# EAGLE design 4WaySwitch4LProto (EAGLE 4.13)
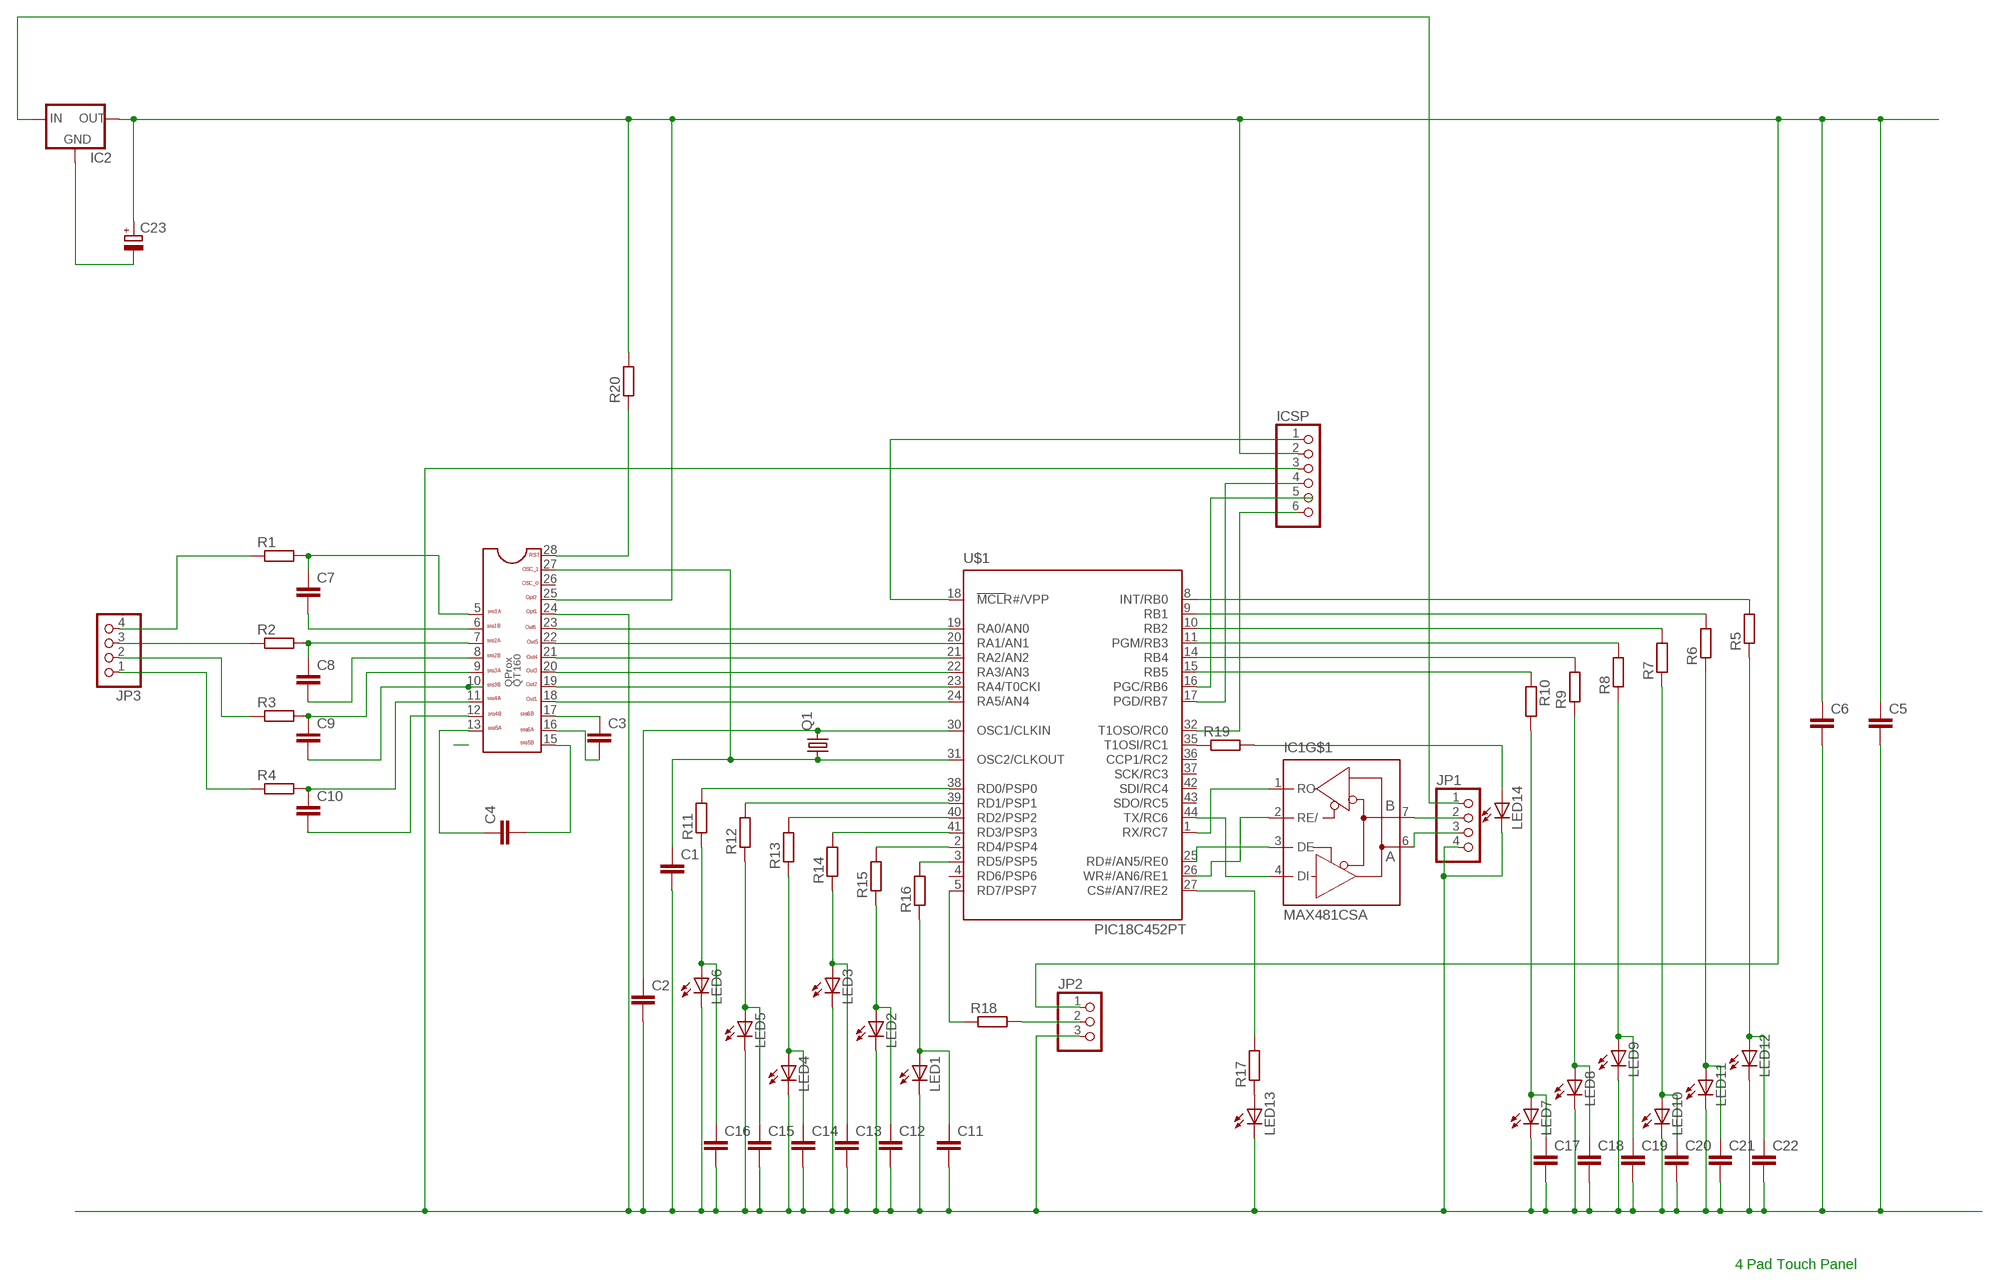
[diagram p0: schematic, sheet 1]

## Parts
C1  C-EUC0805  [C0805]
C2  C-EUC0805  [C0805]
C3  C-EUC0805  [C0805]
C4  C-EUC0805  [C0805]
C5  C-EUC0805  [C0805]
C6  C-EUC0805  [C0805]
C7  C-EUC0805  [C0805]
C8  C-EUC0805  [C0805]
C9  C-EUC0805  [C0805]
C10  C-EUC0805  [C0805]
C11  C-EUC1206  [C1206]
C12  C-EUC1206  [C1206]
C13  C-EUC1206  [C1206]
C14  C-EUC1206  [C1206]
C15  C-EUC1206  [C1206]
C16  C-EUC1206  [C1206]
C17  C-EUC1206  [C1206]
C18  C-EUC1206  [C1206]
C19  C-EUC1206  [C1206]
C20  C-EUC1206  [C1206]
C21  C-EUC1206  [C1206]
C22  C-EUC1206  [C1206]
C23  CPOL-EUD/7343-31W  [D/7343-31W]
IC1  MAX481CSA  [SO08]
IC2  78LXX  [78LXX]
ICSP  PINHD-1X6  [1X06]
JP1  PINHD-1X4  [1X04]
JP2  PINHD-1X3  [1X03]
JP3  PINHD-1X4  [1X04]
LED1  LEDSMT1206  [1206]
LED2  LEDSMT1206  [1206]
LED3  LEDSMT1206  [1206]
LED4  LEDSMT1206  [1206]
LED5  LEDSMT1206  [1206]
LED6  LEDSMT1206  [1206]
LED7  LEDSMT1206  [1206]
LED8  LEDSMT1206  [1206]
LED9  LEDSMT1206  [1206]
LED10  LEDSMT1206  [1206]
LED11  LEDSMT1206  [1206]
LED12  LEDSMT1206  [1206]
LED13  LEDSMT1206  [1206]
LED14  LEDSMT1206  [1206]
Q1  CRYTALHC49S  [HC49/S]
R1  R-EU_R0805  [R0805]
R2  R-EU_R0805  [R0805]
R3  R-EU_R0805  [R0805]
R4  R-EU_R0805  [R0805]
R5  R-EU_R0805  [R0805]
R6  R-EU_R0805  [R0805]
R7  R-EU_R0805  [R0805]
R8  R-EU_R0805  [R0805]
R9  R-EU_R0805  [R0805]
R10  R-EU_R0805  [R0805]
R11  R-EU_R0805  [R0805]
R12  R-EU_R0805  [R0805]
R13  R-EU_R0805  [R0805]
R14  R-EU_R0805  [R0805]
R15  R-EU_R0805  [R0805]
R16  R-EU_R0805  [R0805]
R17  R-EU_R1206  [R1206]
R18  R-EU_R1210  [R1210]
R19  R-EU_M1206  [M1206]
R20  R-EU_M1206  [M1206]
U$1  PIC18C452PT  [TQFP44]
U$2  QPROX160  [SSOP28]

## Nets
GND: C1.2 C2.2 C5.2 C6.2 C11.2 C12.2 C13.2 C14.2 C15.2 C16.2 C17.2 C18.2 C19.2 C20.2 C21.2 C22.2 ICSP.3 JP1.4 JP2.3 LED1.C LED2.C LED3.C LED4.C LED5.C LED6.C LED7.C LED8.C LED9.C LED10.C LED11.C LED12.C LED13.C LED14.C U$2.24(OPT1)
N$1: IC1.4(DI) U$1.44(TX/RC6)
N$2: IC1.1(RO) U$1.1(RX/RC7)
N$3: IC1.3(DE) U$1.25(RD#/AN5/RE0)
N$4: IC1.2(RE/) U$1.26(WR#/AN6/RE1)
N$5: U$1.19(RA0/AN0) U$2.23(OUT6)
N$6: U$1.20(RA1/AN1) U$2.22(OUT5)
N$7: U$1.21(RA2/AN2) U$2.21(OUT4)
N$8: U$1.22(RA3/AN3) U$2.20(OUT3)
N$9: U$1.23(RA4/T0CKI) U$2.19(OUT2)
N$10: U$1.24(RA5/AN4) U$2.18(OUT1)
N$11: C2.1 Q1.2 U$1.30(OSC1/CLKIN)
N$12: C1.1 Q1.1 U$1.31(OSC2/CLKOUT) U$2.27(OSCI)
N$13: C3.1 U$2.17(SNS6B)
N$14: C3.2 U$2.16(SNS6A)
N$15: C4.2 U$2.15(SNS5B)
N$16: C4.1 U$2.13(SNS5A)
N$17: R11.2 U$1.38(RD0/PSP0)
N$18: R12.2 U$1.39(RD1/PSP1)
N$19: C7.1 R1.2 U$2.5(SNS1A)
N$20: C7.2 U$2.6(SNS1B)
N$21: C8.1 R2.2 U$2.7(SNS2A)
N$22: C8.2 U$2.8(SNS2B)
N$23: C9.1 R3.2 U$2.9(SNS3A)
N$24: C9.2 U$2.10(SNS3B)
N$25: C10.1 R4.2 U$2.11(SNS4A)
N$26: C10.2 U$2.12(SNS4B)
N$27: R5.2 U$1.8(INT/RB0)
N$28: R6.2 U$1.9(RB1)
N$29: R7.2 U$1.10(RB2)
N$30: R8.2 U$1.11(PGM/RB3)
N$31: R9.2 U$1.14(RB4)
N$32: R10.1 U$1.15(RB5)
N$33: R13.2 U$1.40(RD2/PSP2)
N$34: R14.2 U$1.41(RD3/PSP3)
N$35: R15.2 U$1.2(RD4/PSP4)
N$36: R16.2 U$1.3(RD5/PSP5)
N$37: C11.1 LED1.A R16.1
N$38: C12.1 LED2.A R15.1
N$39: C16.1 LED6.A R11.1
N$40: C15.1 LED5.A R12.1
N$41: C14.1 LED4.A R13.1
N$42: C13.1 LED3.A R14.1
N$43: C17.1 LED7.A R10.2
N$44: C18.1 LED8.A R9.1
N$45: C19.1 LED9.A R8.1
N$46: C20.1 LED10.A R7.1
N$47: C21.1 LED11.A R6.1
N$48: C22.1 LED12.A R5.1
N$49: ICSP.1 U$1.18(MCLR#/VPP)
N$50: JP3.4 R1.1
N$51: JP3.3 R2.1
N$52: U$1.16(PGC/RB6)
N$53: ICSP.4 U$1.17(PGD/RB7)
N$54: ICSP.6 U$1.32(T1OSO/RC0)
N$55: JP3.2 R3.1
N$56: JP3.1 R4.1
N$58: IC1.6(A) JP1.3
N$59: IC1.7(B) JP1.2
N$60: R20.1 U$2.28(RST)
N$61: LED13.A R17.1
N$62: R17.2 U$1.27(CS#/AN7/RE2)
N$63: C23.- IC2.GND
N$65: JP2.2 R18.2
N$66: R18.1 U$1.5(RD7/PSP7)
N$67: R19.1 U$1.35(T1OSI/RC1)
N$68: LED14.A R19.2
VCC: C5.1 C6.1 C23.+ IC2.OUT ICSP.2 JP2.1 R20.2 U$2.25(OPT2)
VDD: IC2.IN JP1.1
Unconnected: ICSP.5 U$1.4(RD6/PSP6) U$1.36(CCP1/RC2) U$1.37(SCK/RC3) U$1.42(SDI/RC4) U$1.43(SDO/RC5) U$2.26(OSCO)

## Notes on the sheet
- 4 Pad Touch Panel

## Power pins joined to a net without a drawn wire
GND: IC1.5(GND) U$1.7(GND) U$1.28(GND) U$2.1(GND) U$2.2(GND) U$2.14(GND)
VCC: U$1.6(VCC) U$1.29(VCC) U$2.3(VCC) U$2.4(VCC)
VDD: IC1.8(VDD)

## Library data of the parts
C1-C22 = rcl:C-EU: CAPACITOR, European symbol
C23 = rcl:CPOL-EU: POLARIZED CAPACITOR, European symbol
IC1 = maxim:MAX481CSA: RS485 TRANSEIVER
IC2 = v-reg:78LXX: VOLTAGE REGULATOR
ICSP = pinhead:PINHD-1X6: PIN HEADER
JP1 JP3 = pinhead:PINHD-1X4: PIN HEADER
JP2 = pinhead:PINHD-1X3: PIN HEADER
LED1-LED14 = led:LED: LED OSRAM: - CHIPLED LG R971, LG N971, LY N971, LG Q971, LY Q971, LO R971, LY R971 LH N974, LH R974 LS Q976, LO Q976, LY Q976 LO Q996 - Hyper CHIPLED LW Q18S LB Q993, LB Q99A, LB R99A - SideLED LS A670, LO A670, LY A670, LG A670, LP A670 LB A673, LV A673, LT A673, LW A673 LH A674 LY A675 LS A676, LA A676, LO A676, LY A676, LW A676 LS A679, LY A679, LG A679 - Hyper Micro SIDELED® LS Y876, LA Y876, LO Y876, LY Y876 LT Y87S - SmartLED LW L88C, LW L88S LB L89C, LB L89S, LG L890 LS L89K, LO L89K, LY L89K LS L896, LA L896, LO L896, LY L896 - TOPLED LS T670, LO T670, LY T670, LG T670, LP T670 LSG T670, LSP T670, LSY T670, LOP T670, LYG T670 LG T671, LOG T671, LSG T671 LB T673, LV T673, LT T673, LW T673 LH T674 LS T676, LA T676, LO T676, LY T676, LB T676, LH T676, LSB T676, LW T676 LB T67C, LV T67C, LT T67C, LS T67K, LO T67K, LY T67K, LW E67C LS E67B, LA E67B, LO E67B, LY E67B, LB E67C, LV E67C, LT E67C LW T67C LS T679, LY T679, LG T679 LS T770, LO T770, LY T770, LG T770, LP T770 LB T773, LV T773, LT T773, LW T773 LH T774 LS E675, LA E675, LY E675, LS T675 LS T776, LA T776, LO T776, LY T776, LB T776 LHGB T686 LT T68C, LB T68C - Hyper Mini TOPLED® LB M676 - Mini TOPLED Santana® LG M470 LS M47K, LO M47K, LY M47K Source: http://www.osram.convergy.de/
Q1 = crystal:CRYTAL: CRYSTAL
R1-R20 = rcl:R-EU_: RESISTOR, European symbol
U$1 = micro-pic18xxx:PIC18C4*2?: High-Performance Microcontrollers with 10-Bit A/D
U$2 = QProx:QPROX160

## Board
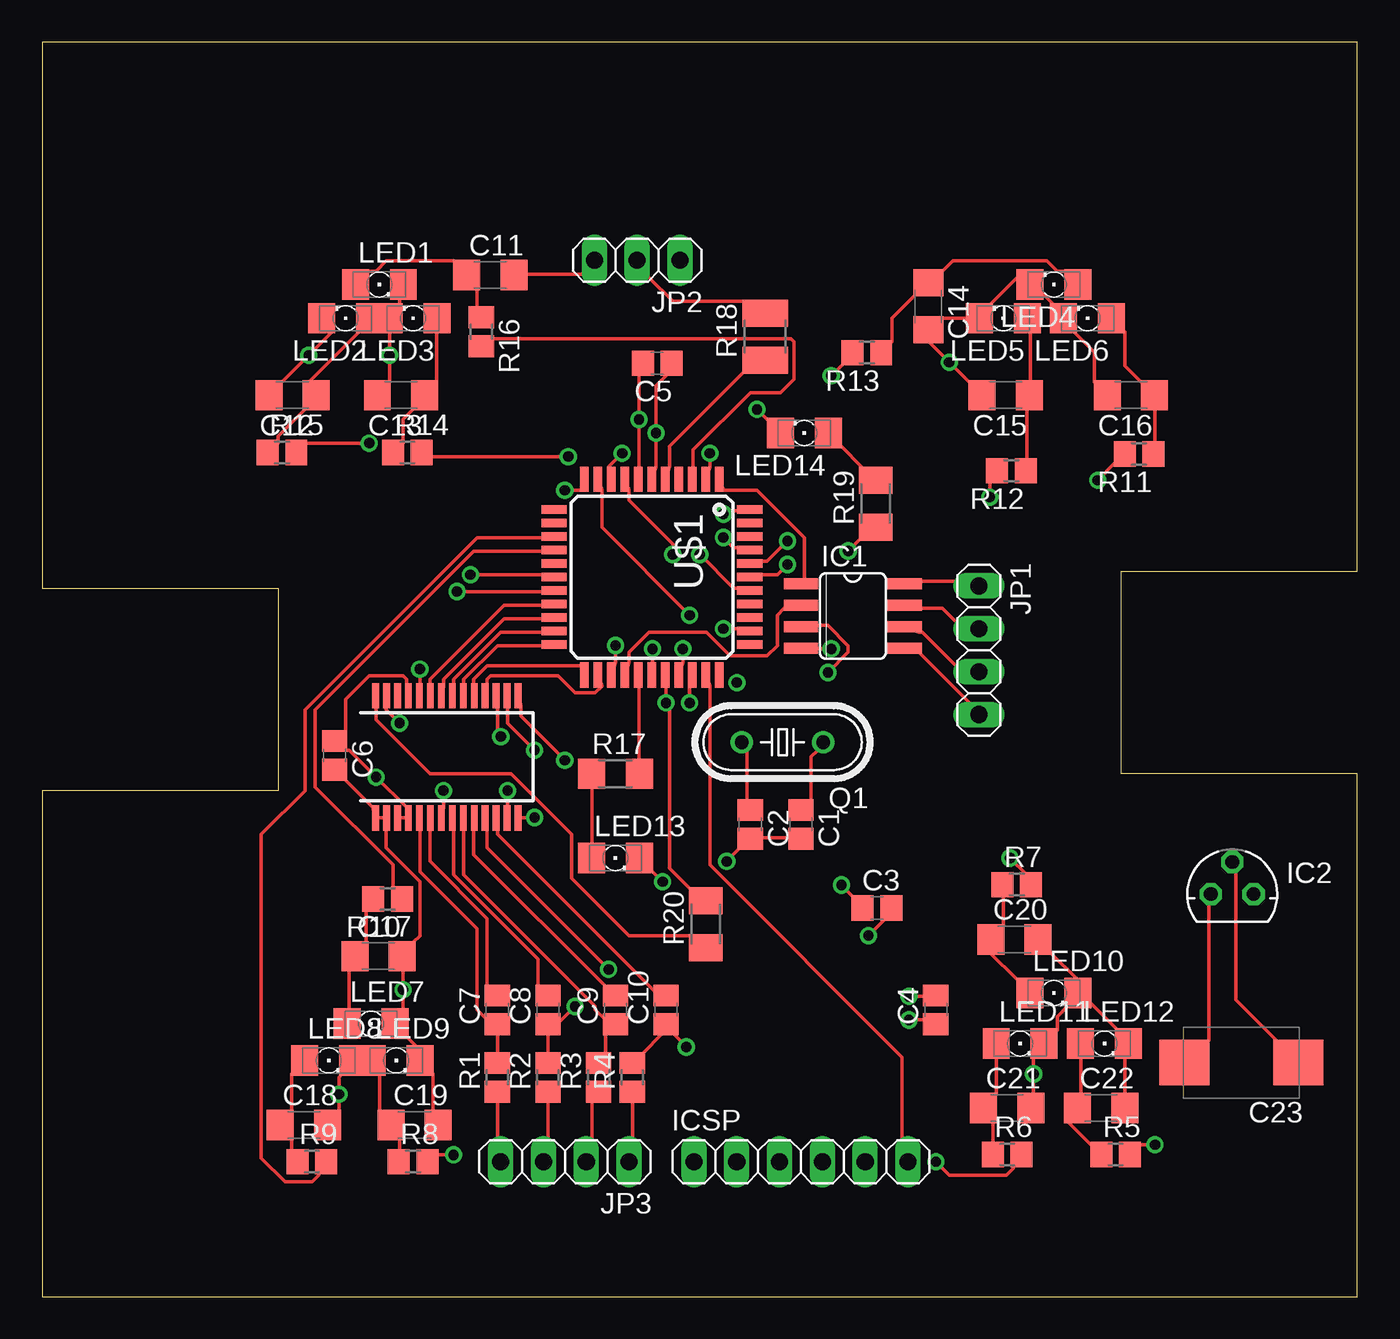
[diagram p1: board, top side]
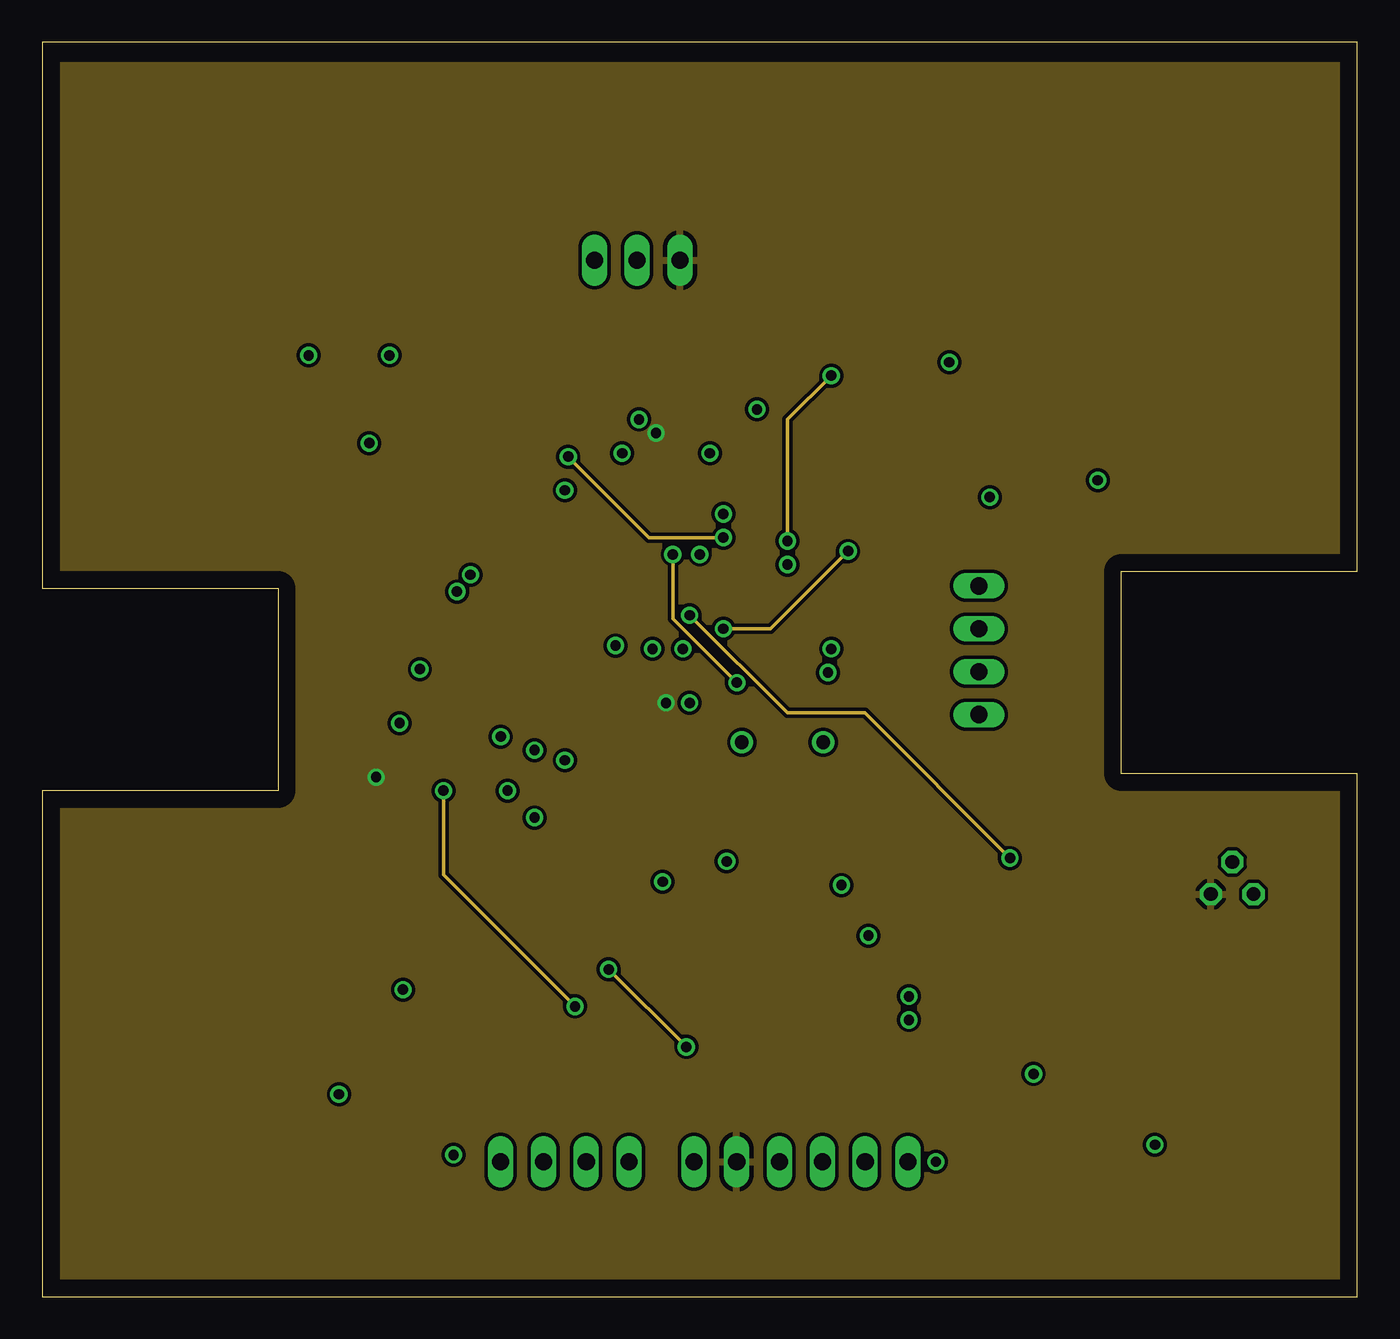
[diagram p2: board, inner layer VCC]
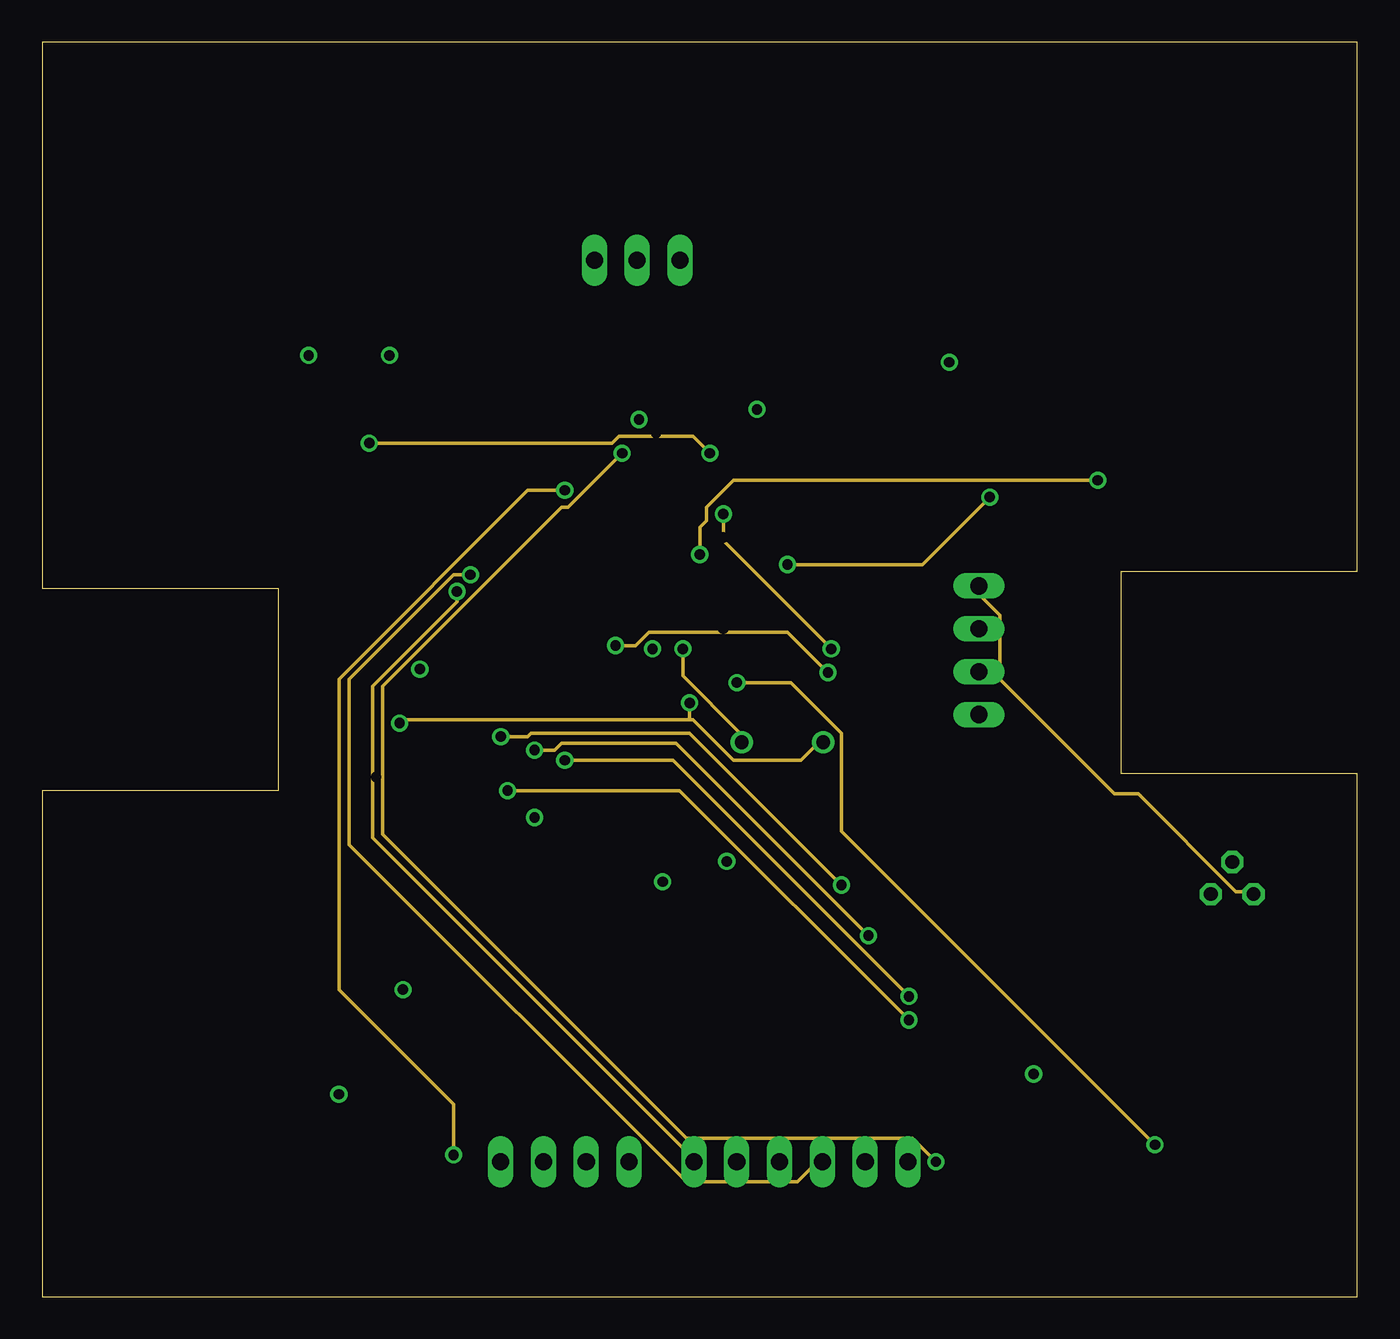
[diagram p3: board, inner layer route15]
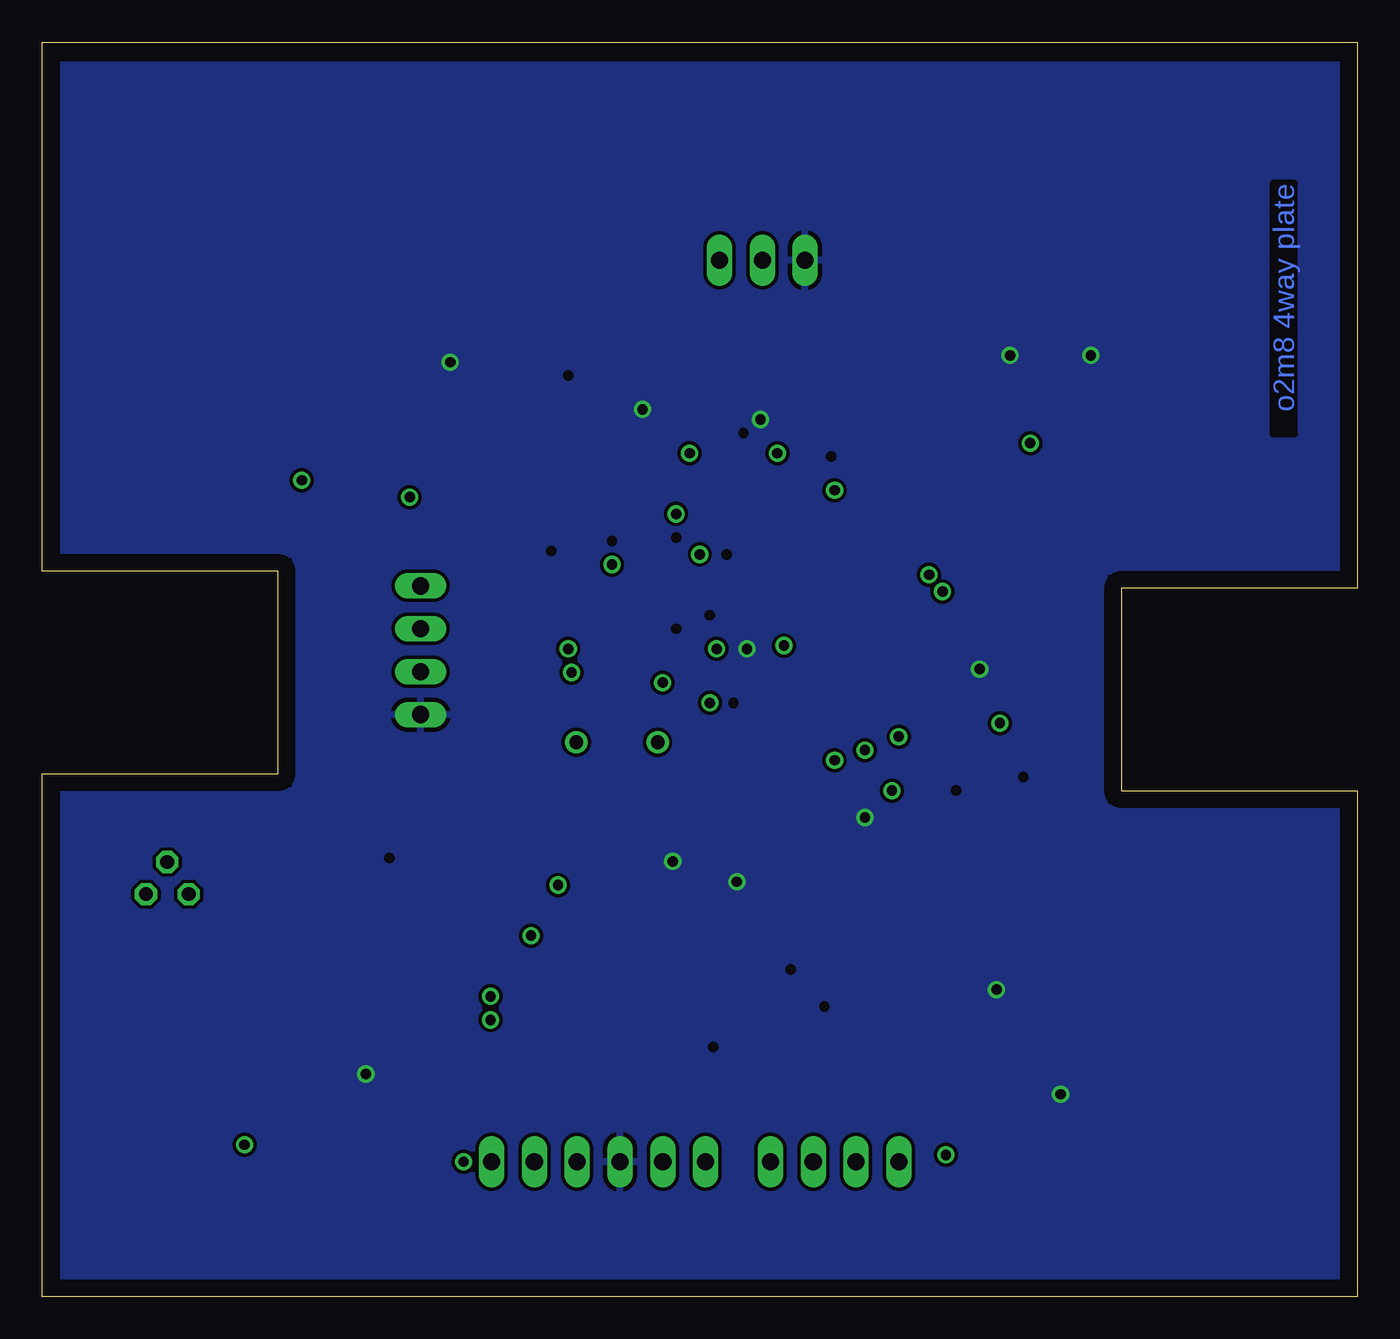
[diagram p4: board, bottom side, seen from below]

Size 78 x 74.37 mm. Coordinates in mm from the lower left corner, seen from the top.
Outline: 0,74.37 78,74.37 78,43 64,43 64,31 78,31 78,0 0,0 0,30 14,30 14,42 0,42 0,74.37
Outline: 0.53,74.37 0,74.37
Copper layers ((1*2)*(15*16)): Top 0.035mm / dielectric 1.5mm / VCC 0.035mm / dielectric 0.15mm / route15 0.035mm / dielectric 0.2mm / Bottom 0.035mm
Design rules "default": minimum track width 8mil, minimum drill 24mil, track to track 8mil, track to pad 8mil, pad to pad 8mil, via to via 8mil, smd to smd 8mil, copper to edge 40mil, drill to drill 8mil, minimum pad ring 10mil, minimum via ring 8mil, stop-mask expansion 4mil, vias tented up to drill 0mil, thermal gap 10mil

### Footprints (pad centres in the part's own frame; a part is rotated, then mirrored left to right if it is on the bottom)
C0805 = smd 1.3 x 1.5: 1 -0.85,0; 2 0.85,0
C1206 = smd 1.6 x 1.8: 1 -1.4,0; 2 1.4,0
D/7343-31W = smd 2.95 x 2.7: + 3.375,0; - -3.375,0
SO08 = smd 0.66 x 2.032: 1 -1.905,-3.073; 2 -0.635,-3.073; 3 0.635,-3.073; 4 1.905,-3.073; 5 1.905,3.073; 6 0.635,3.073; 7 -0.635,3.073; 8 -1.905,3.073
78LXX = drill 0.813 octagon: GND 0,1.905; IN 1.27,0; OUT -1.27,0
1X06 = drill 1.016 long: 1 -6.35,0; 2 -3.81,0; 3 -1.27,0; 4 1.27,0; 5 3.81,0; 6 6.35,0
1X04 = drill 1.016 long: 1 -3.81,0; 2 -1.27,0; 3 1.27,0; 4 3.81,0
1X03 = drill 1.016 long: 1 -2.54,0; 2 0,0; 3 2.54,0
1206 = smd 1.6 x 1.803: A -1.422,0; C 1.422,0
HC49/S = drill 0.813 round: 1 -2.413,0; 2 2.413,0
R0805 = smd 1.3 x 1.5: 1 -0.85,0; 2 0.85,0
R1206 = smd 1.6 x 1.803: 1 -1.422,0; 2 1.422,0
R1210 = smd 1.6 x 2.7: 1 -1.4,0; 2 1.4,0
M1206 = smd 1.6 x 2: 1 -1.4,0; 2 1.4,0
TQFP44 = smd 1.5 x 0.5: 1 -5.8,4; 2 -5.8,3.2; 3 -5.8,2.4; 4 -5.8,1.6; 5 -5.8,0.8; 6 -5.8,0; 7 -5.8,-0.8; 8 -5.8,-1.6; 9 -5.8,-2.4; 10 -5.8,-3.2; 11 -5.8,-4; 23 5.8,-4; 24 5.8,-3.2; 25 5.8,-2.4; 26 5.8,-1.6; 27 5.8,-0.8; 28 5.8,0; 29 5.8,0.8; 30 5.8,1.6; 31 5.8,2.4; 32 5.8,3.2; 33 5.8,4 | smd 0.5 x 1.5: 12 -4,-5.8; 13 -3.2,-5.8; 14 -2.4,-5.8; 15 -1.6,-5.8; 16 -0.8,-5.8; 17 0,-5.8; 18 0.8,-5.8; 19 1.6,-5.8; 20 2.4,-5.8; 21 3.2,-5.8; 22 4,-5.8; 34 4,5.8; 35 3.2,5.8; 36 2.4,5.8; 37 1.6,5.8; 38 0.8,5.8; 39 0,5.8; 40 -0.8,5.8; 41 -1.6,5.8; 42 -2.4,5.8; 43 -3.2,5.8; 44 -4,5.8
SSOP28 = smd 0.4 x 1.5: 1 -4.225,-3.625; 2 -3.575,-3.625; 3 -2.925,-3.625; 4 -2.275,-3.625; 5 -1.625,-3.625; 6 -0.975,-3.625; 7 -0.325,-3.625; 8 0.325,-3.625; 9 0.975,-3.625; 10 1.625,-3.625; 11 2.275,-3.625; 12 2.925,-3.625; 13 3.575,-3.625; 14 4.225,-3.625; 15 4.225,3.625; 16 3.575,3.625; 17 2.925,3.625; 18 2.275,3.625; 19 1.625,3.625; 20 0.975,3.625; 21 0.325,3.625; 22 -0.325,3.625; 23 -0.975,3.625; 24 -1.625,3.625; 25 -2.275,3.625; 26 -2.925,3.625; 27 -3.575,3.625; 28 -4.225,3.625

### Placement (x,y rotation side)
C1  45,28 270 top
C2  42,28 270 top
C3  49.51,23.04 0 top
C4  53,17 90 top
C5  36.48,55.34 180 top
C6  17.34,32.09 270 top
C7  27,17 90 top
C8  30,17 90 top
C9  34,17 90 top
C10  37,17 90 top
C11  26.58,60.56 0 top
C12  14.85,53.44 180 top
C13  21.28,53.44 180 top
C14  52.56,58.71 270 top
C15  57.14,53.44 180 top
C16  64.57,53.44 180 top
C17  19.95,20.18 0 top
C18  15.52,10.18 0 top
C19  22.09,10.18 0 top
C20  57.66,21.18 0 top
C21  57.23,11.18 0 top
C22  62.8,11.18 0 top
C23  71.12,13.87 180 top
IC1  48.08,40.35 270 top
IC2  70.58,23.86 0 top
ICSP  45,8 0 top
JP1  55.56,38.32 270 top
JP2  35.29,61.44 180 top
JP3  31,8 180 top
LED1  20,60 0 top
LED2  18,58 180 top
LED3  22,58 180 top
LED4  60,60 180 top
LED5  57,58 180 top
LED6  62,58 180 top
LED7  19.51,16.18 0 top
LED8  17,14 0 top
LED9  21,14 0 top
LED10  60,18 0 top
LED11  58,15 0 top
LED12  63,15 0 top
LED13  34,26 0 top
LED14  45.2,51.2 180 top
Q1  43.91,32.87 180 top
R1  27,13 90 top
R2  30,13 90 top
R3  33,13 90 top
R4  35,13 90 top
R5  63.66,8.42 0 top
R6  57.23,8.42 0 top
R7  57.8,24.42 0 top
R8  22,8 0 top
R9  16,8 0 top
R10  20.49,23.58 180 top
R11  65.05,49.96 180 top
R12  57.48,48.96 180 top
R13  48.91,55.96 180 top
R14  21.66,50.04 0 top
R15  14.23,50.04 0 top
R16  26.04,57.2 270 top
R17  34,31 0 top
R18  42.87,56.91 90 top
R19  49.44,47.01 90 top
R20  39.35,22.08 90 top
U$1  36.16,42.66 270 top
U$2  24,32 0 top

### Tracks (layer width: path | path; a pad name or v marks a point on that pad's centre or on a via)
GND  (via drill 0.61)
  Top 0.203: C6.2 18,30.6 19.6,29 U$2.1 19.8,28.4 20.4,28.4 U$2.2 20.4,27.8 20.4,26.6 22.4,24.6 22.4,21.4 22,21 C17.2 21.4,19.4 v21.4,18.2 21.4,17 LED7.C 21.6,15.4 22.2,14.8 LED9.C 23.2,13.2 23.2,11 C19.2 | C15.2 55,54.2 v53.8,55.4 52.6,56.6 C14.2 53.4,58 LED5.C 56.2,58.8 57.8,60.4 LED4.C 59.2,59.4 59.4,59.4 60,58.8 LED6.C 61.2,57.2 62.4,56 62.4,54.2 C16.2 | C21.2 58.8,12 v58.8,13.2 58.8,14.2 LED11.C 60.2,15.8 60.2,16.6 60.8,17.2 LED10.C | C22.2 64.2,14.2 LED12.C 63.8,15.8 62.2,17.4 LED10.C | C20.2 59.8,20.4 61.4,18.8 LED10.C | C13.2 20.6,54.2 v20.6,55.8 20.6,57.2 LED3.C 21.2,58.8 21.2,59.2 LED1.C | C12.2 14.2,54.2 v15.8,55.8 17.2,57.2 LED2.C | U$1.7 35.4,49.2 v35.4,52 35.4,54.6 C5.2 | C18.2 17.6,11 v17.6,12 17.6,13 17.8,13.2 LED8.C | C1.2 44.4,27.2 42.6,27.2 C2.2 41.4,26.6 v40.6,25.8 | v29.2,28.4 28.4,28.4 U$2.14 | v22.4,37.2 22.4,36.2 U$2.24 | v36.2,38.4 36.2,37.6 U$1.28 | C11.2 28.6,60.6 32,60.6 JP2.3 | v36.8,24.6 36.2,25.2 LED13.C | v42.4,52.6 43,52 LED14.C | IC1.5 52,38.2 55,35.2 JP1.4
  pour Bottom: 1,1 1,29 15,29 15,43 1,43 1,73 77,73 77,44 63,44 63,30 77,30 77,1
N$1  (via drill 0.61)
  Top 0.203: v40.4,46.4 40.6,46.6 41.4,46.6 U$1.44 | v46.8,38.4 46,38.4 IC1.4
  route15 0.203: v40.4,46.4 40.4,44.8 v46.8,38.4
N$2
  Top 0.203: U$1.1 40.4,47.8 42.4,47.8 45.2,45 45.2,42.4 IC1.1
N$3  (via drill 0.61)
  Top 0.203: v34,38.6 34,37.6 U$1.25 | v46.6,37 47.8,38.2 47.8,38.6 46.6,39.8 46,39.8 IC1.3
  route15 0.203: v34,38.6 35.2,38.6 36,39.4 44.2,39.4 v46.6,37
N$4
  Top 0.203: U$1.26 34.8,37.6 34.8,38.2 36,39.4 39.4,39.4 40.8,38 43,38 43.6,38.6 43.6,40.4 44,40.8 IC1.2
N$5
  Top 0.203: U$2.23 23,36.2 23,36.6 27.4,41 29.8,41 U$1.19
N$6
  Top 0.203: U$2.22 23.8,36.2 23.8,36.6 27.4,40.2 29.8,40.2 U$1.20
N$7
  Top 0.203: U$2.21 24.4,36.2 24.4,36.6 27.2,39.4 29.8,39.4 U$1.21
N$8
  Top 0.203: U$2.20 25,36.2 25,36.6 27,38.6 29.8,38.6 U$1.22
N$9
  Top 0.203: U$2.19 25.6,36.2 25.6,36.6 26.4,37.4 32,37.4 U$1.23
N$10
  Top 0.203: U$2.18 26.4,36.2 26.4,36.6 26.6,36.8 30.6,36.8 31.6,35.8 32.8,35.8 33.2,36.2 U$1.24
N$11  (via drill 0.61)
  Top 0.203: C2.1 41.8,29.4 41.8,32.4 Q1.2 | v38,38.4 38,37.6 U$1.30
  route15 0.203: v38,38.4 38,36.8 41.4,33.4 Q1.2
N$12  (via drill 0.61)
  Top 0.203: v21.2,34 20.4,34.8 20.4,35 U$2.27 | v38.4,35.2 38.4,36.2 U$1.31 | C1.1 45.6,29.4 45.6,32 46,32.4 Q1.1
  route15 0.203: v21.2,34 21.4,34.2 38.4,34.2 | 38.4,34.2 38.6,34.2 41,31.8 45,31.8 45.8,32.6 Q1.1 | 38.4,34.2 v38.4,35.2
N$13  (via drill 0.61)
  Top 0.203: v27.2,33.2 27,33.4 27,35 U$2.17 | v47.4,24.4 48.2,23.6 C3.1
  route15 0.203: v27.2,33.2 28.8,33.2 29,33.4 38.4,33.4 v47.4,24.4
N$14  (via drill 0.61)
  Top 0.203: v29.2,32.4 27.6,34 27.6,35 U$2.16 | v49,21.4 50,22.4 C3.2
  route15 0.203: v29.2,32.4 30.4,32.4 30.8,32.8 37.6,32.8 v49,21.4
N$15  (via drill 0.61)
  Top 0.203: v31,31.8 28.4,34.4 28.4,35 U$2.15 | v51.4,17.8 52.4,17.8 C4.2
  route15 0.203: v31,31.8 37.4,31.8 v51.4,17.8
N$16  (via drill 0.61)
  Top 0.203: v27.6,30 27.6,29 U$2.13 | v51.4,16.4 52.4,16.4 C4.1
  route15 0.203: v27.6,30 37.8,30 v51.4,16.4
N$17  (via drill 0.61)
  Top 0.203: v39,44 41,42 41.4,42 U$1.38 | v62.6,48.4 63.6,49.4 R11.2
  route15 0.203: v39,44 39,45.6 39.4,46 39.4,46.8 41,48.4 v62.6,48.4
N$18  (via drill 0.61)
  Top 0.203: v44.2,43.4 43.6,42.8 42.6,42.8 U$1.39 | v56.2,47.4 56.2,48.4 R12.2
  route15 0.203: v44.2,43.4 52.2,43.4 v56.2,47.4
N$19
  Top 0.203: R1.2 C7.1 26.4,16.4 25.8,17 25.8,21.8 22.4,25.2 22.4,27.8 U$2.5
N$20
  Top 0.203: C7.2 26.4,18.4 26.4,22.4 23,25.8 23,27.8 U$2.6
N$21  (via drill 0.61 layers 1-2)
  Top 0.203: R2.2 C8.1 30.6,16.2 v31.6,17.2 | v23.8,30 23.8,29 U$2.7
  VCC 0.203: v23.8,30 23.8,25 v31.6,17.2
N$22
  Top 0.203: C8.2 29.4,18.4 29.4,20 24.4,25 24.4,27.8 U$2.8
N$23
  Top 0.203: R3.2 33.4,14.4 33.4,15.6 C9.1 33.4,16.4 32.8,17 32.8,17.2 25,25 25,27.8 U$2.9
N$24
  Top 0.203: C9.2 33.4,18.4 25.6,26.2 25.6,27.8 U$2.10
N$25  (via drill 0.61 layers 1-2)
  Top 0.203: R4.2 35.6,14.4 36.8,15.6 C10.1 37.4,15.6 v38.2,14.8 | v33.6,19.4 26.4,26.6 26.4,27.8 U$2.11
  VCC 0.203: v38.2,14.8 v33.6,19.4
N$26
  Top 0.203: U$2.12 27,27.8 27,27.4 36.4,18 C10.2
N$27  (via drill 0.61, 0.61 layers 1-2)
  Top 0.203: v66,9 65,9 R5.2 | v37.4,44 37.4,44.6 34.8,47.2 34.8,47.8 U$1.8
  VCC 0.203: v41.2,36.4 37.4,40.2 v37.4,44
  route15 0.203: v66,9 47.4,27.6 47.4,33.4 44.4,36.4 v41.2,36.4
N$28  (via drill 0.61)
  Top 0.203: v53,8 53.8,7.2 57.2,7.2 57.6,7.6 57.6,7.8 R6.2 | v34.4,50 33.6,49.2 U$1.9
  route15 0.203: v53,8 51.6,9.4 38.2,9.4 20.2,27.4 20.2,36.2 30.8,46.8 31.2,46.8 v34.4,50
N$29  (via drill 0.61 layers 1-2)
  Top 0.203: v38.4,40.4 33.2,45.6 33.2,47.8 U$1.10 | v57.4,26 58.4,25 R7.2
  VCC 0.203: v38.4,40.4 44.2,34.6 48.8,34.6 v57.4,26
N$30  (via drill 0.61)
  Top 0.203: v24.4,8.4 23.4,8.4 R8.2 | v31,47.8 32,47.8 U$1.11
  route15 0.203: v24.4,8.4 24.4,11.4 17.6,18.2 17.6,36.6 28.8,47.8 v31,47.8
N$31
  Top 0.203: R9.2 16.4,7.4 16.4,7.2 16,6.8 14.4,6.8 13,8.2 13,27.4 15.6,30 15.6,34.8 25.8,45 29.8,45 U$1.14
N$32
  Top 0.203: R10.1 20.8,24.2 20.8,25.6 16.2,30.2 16.2,34.8 25.6,44.2 29.8,44.2 U$1.15
N$33  (via drill 0.61 layers 1-2)
  Top 0.203: v44.2,44.8 43,43.6 42.6,43.6 U$1.40 | v46.8,54.6 47.6,55.4 R13.2
  VCC 0.203: v44.2,44.8 44.2,52 v46.8,54.6
N$34  (via drill 0.61 layers 1-2)
  Top 0.203: v31.2,49.8 23,49.8 R14.2 | v40.4,45 41,44.4 41.4,44.4 U$1.41
  VCC 0.203: v31.2,49.8 36,45 v40.4,45
N$35  (via drill 0.61)
  Top 0.203: v19.4,50.6 15.6,50.6 R15.2 | v39.6,50 39.6,49.2 U$1.2
  route15 0.203: v19.4,50.6 33.8,50.6 34.2,51 38.6,51 v39.6,50
N$36
  Top 0.203: R16.2 26.6,56.8 44.4,56.8 44.6,56.6 44.6,54.4 43.8,53.6 42,53.6 38.6,50.2 38.6,49.2 U$1.3
N$37
  Top 0.203: R16.1 25.8,58.6 25.8,59.8 C11.1 24.4,61.4 20.4,61.4 19.8,60.8 19.2,60.8 LED1.A
N$38
  Top 0.203: R15.1 14,50.6 14,51 15.6,52.6 C12.1 15.8,54.2 18.8,57.2 LED2.A
N$39
  Top 0.203: R11.1 66,50.6 66,52.6 C16.1 65.2,54.2 64.2,55.2 64.2,57.2 LED6.A
N$40
  Top 0.203: R12.1 58.4,49.6 58.4,52.6 C15.1 58.6,54.2 58.6,57.2 LED5.A
N$41
  Top 0.203: R13.1 50.4,56.6 50.4,58 51.8,59.4 C14.1 53.4,60.8 54,61.4 59.6,61.4 60.2,60.8 60.8,60.8 LED4.A
N$42
  Top 0.203: R14.1 21.4,50.6 21.4,52 22,52.6 C13.1 23.4,54.2 23.4,57.2 LED3.A
N$43
  Top 0.203: R10.2 19.2,23 19.2,21 C17.1 18.2,19.4 18.2,17 LED7.A
N$44
  Top 0.203: R9.1 14.8,8.6 14.8,9.4 C18.1 14.8,11 14.8,13.2 LED8.A
N$45
  Top 0.203: R8.1 21.2,8.6 21.2,9.4 C19.1 20,11 20,13.2 LED9.A
N$46
  Top 0.203: R7.1 57,23.8 57,22 C20.1 56.2,20.4 57.8,18.8 LED10.A
N$47
  Top 0.203: R6.1 56.4,9 56.4,10.4 C21.1 56.6,12 56.6,14.2 LED11.A
N$48
  Top 0.203: R5.1 62.2,9 60.8,10.4 C22.1 61.6,12 61.6,14.2 LED12.A
N$49  (via drill 0.61)
  Top 0.203: v24.6,41.8 29.8,41.8 U$1.18
  route15 0.203: v24.6,41.8 24.6,41.2 19.6,36.2 19.6,27.2 38.2,8.6 ICSP.1
N$50
  Top 0.203: R1.1 27,9.4 JP3.4
N$51
  Top 0.203: R2.1 30,9.4 JP3.3
N$53  (via drill 0.61)
  Top 0.203: v25.4,42.8 29.8,42.8 U$1.17
  route15 0.203: v25.4,42.8 24.4,42.8 18.2,36.6 18.2,26.8 38.2,6.8 44.8,6.8 45.6,7.6 ICSP.4
N$54
  Top 0.203: U$1.32 39.6,36.2 39.6,25.6 51,14.2 51,9.4 ICSP.6
N$55
  Top 0.203: R3.1 32.6,11.6 32.6,9.4 JP3.2
N$56
  Top 0.203: R4.1 35,9.4 JP3.1
N$58
  Top 0.203: IC1.6 52,39.4 52.2,39.4 54.2,37.4 JP1.3
N$59
  Top 0.203: IC1.7 52,40.8 53.4,40.8 54.2,40 JP1.2
N$60
  Top 0.203: U$2.28 19.8,35 19.8,34.2 23,31 27.8,31 31.4,27.4 31.4,24.8 34.8,21.4 38.4,21.4 R20.1
N$61
  Top 0.203: LED13.A 32.6,26.8 32.6,30.2 R17.1
N$62
  Top 0.203: U$1.27 35.4,36.2 35.4,31.8 R17.2
N$63
  Top 0.203: IC2.GND 70.8,25.2 70.8,17.6 73.2,15.2 C23.-
N$65
  Top 0.203: R18.2 41.6,59 37.4,59 36,60.4 JP2.2
N$66
  Top 0.203: U$1.5 37.2,49.2 37.2,50.4 41.6,54.8 R18.1
N$67  (via drill 0.61 layers 1-2)
  Top 0.203: v40.4,39.6 41.4,39.6 U$1.35 | v47.8,44.2 48.6,45 R19.1
  VCC 0.203: v40.4,39.6 43.2,39.6 v47.8,44.2
N$68
  Top 0.203: LED14.A 47.4,50.4 48.6,49.2 R19.2
VCC  (via drill 0.61 layers 1-2)
  Top 0.203: U$2.3 21.2,28.4 21.6,28.4 U$2.4 21.6,29 v19.8,30.8 18.2,32.4 18,32.4 C6.1 18,33.4 18,35.4 19.4,36.8 21.4,36.8 21.6,36.6 21.6,36.2 U$2.25 | U$1.6 36.4,49.2 v36.4,51.2 36.4,54 37,54.6 C5.1 | U$1.29 37,36.2 v37,35.2 37.2,34.8 37.2,25.4 38.4,24.2 R20.2 | C23.+ 69.2,15.2 69.2,23.2 IC2.OUT
  pour VCC: 1,43 1,73 77,73 77,44 68,44 68,30 77,30 77,1 1,1 1,2 1,29 10,29 10,43
VDD
  Top 0.203: IC1.8 52,42.4 54.2,42.4 JP1.1
  route15 0.203: IC2.IN 71.2,24 70.8,24 65,29.8 63.6,29.8 56.8,36.6 56.8,40.4 55.8,41.4 JP1.1

### Text on the board
Bottom: o2m8 4way plate